# EAGLE board ickenham (EAGLE 9.6.2)
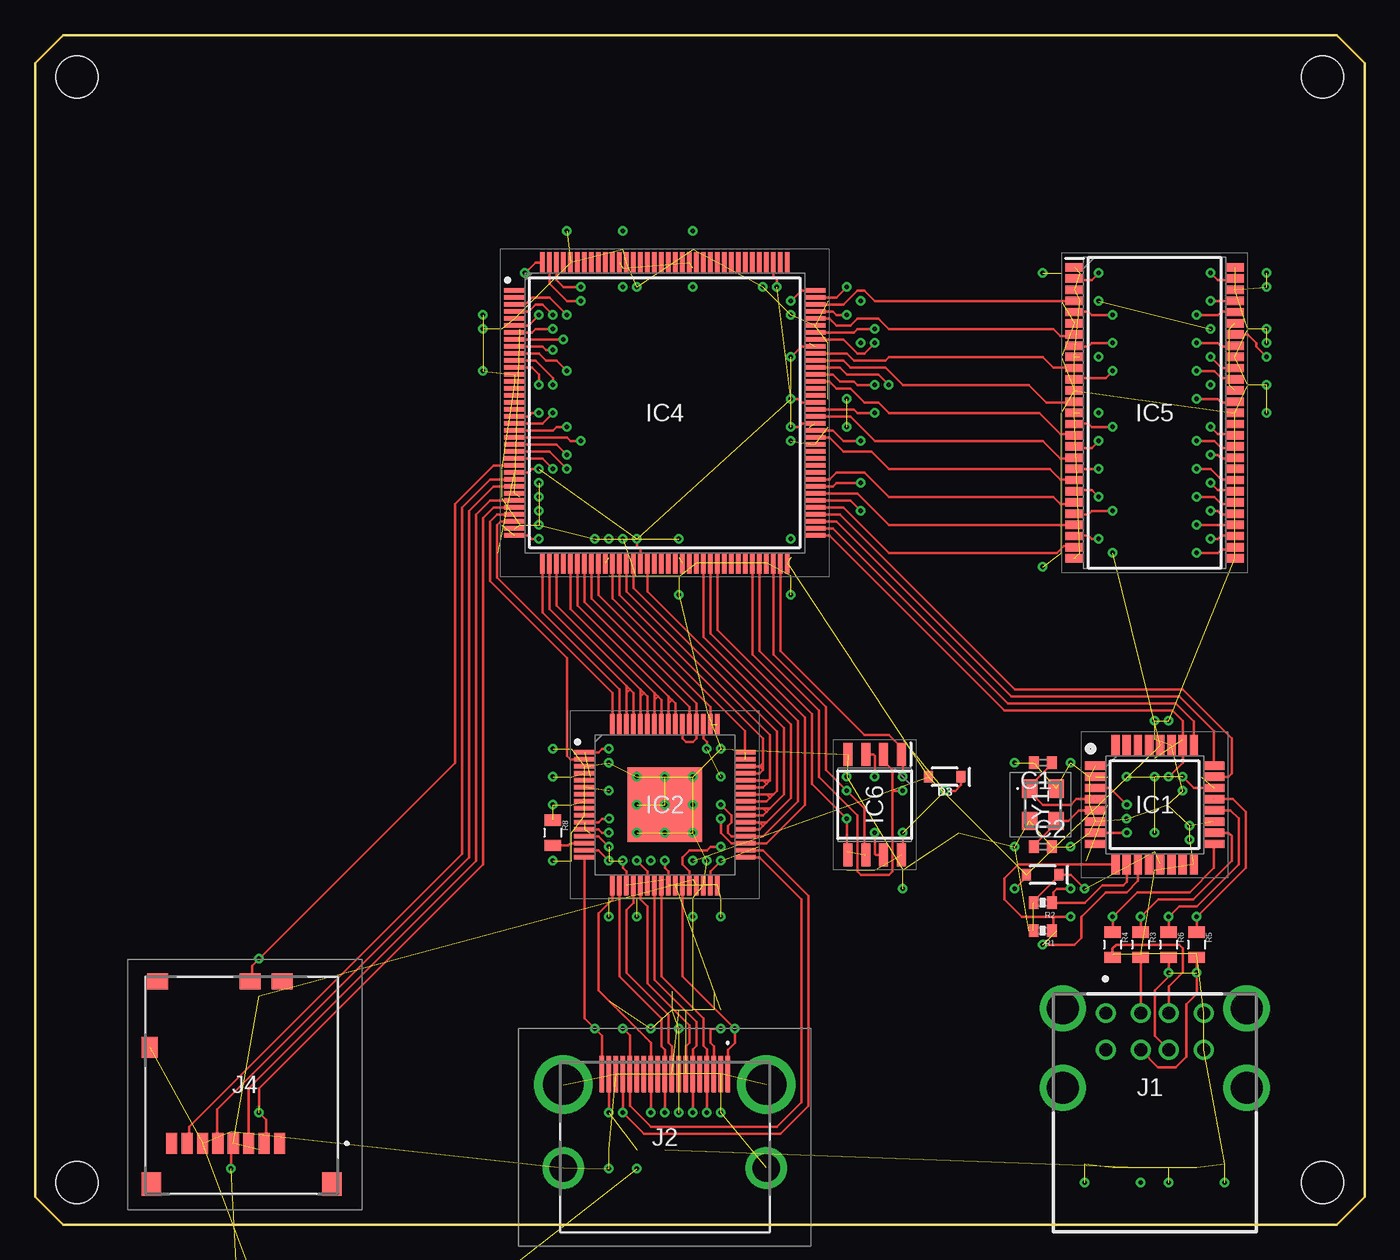
[diagram p6: board, top side]
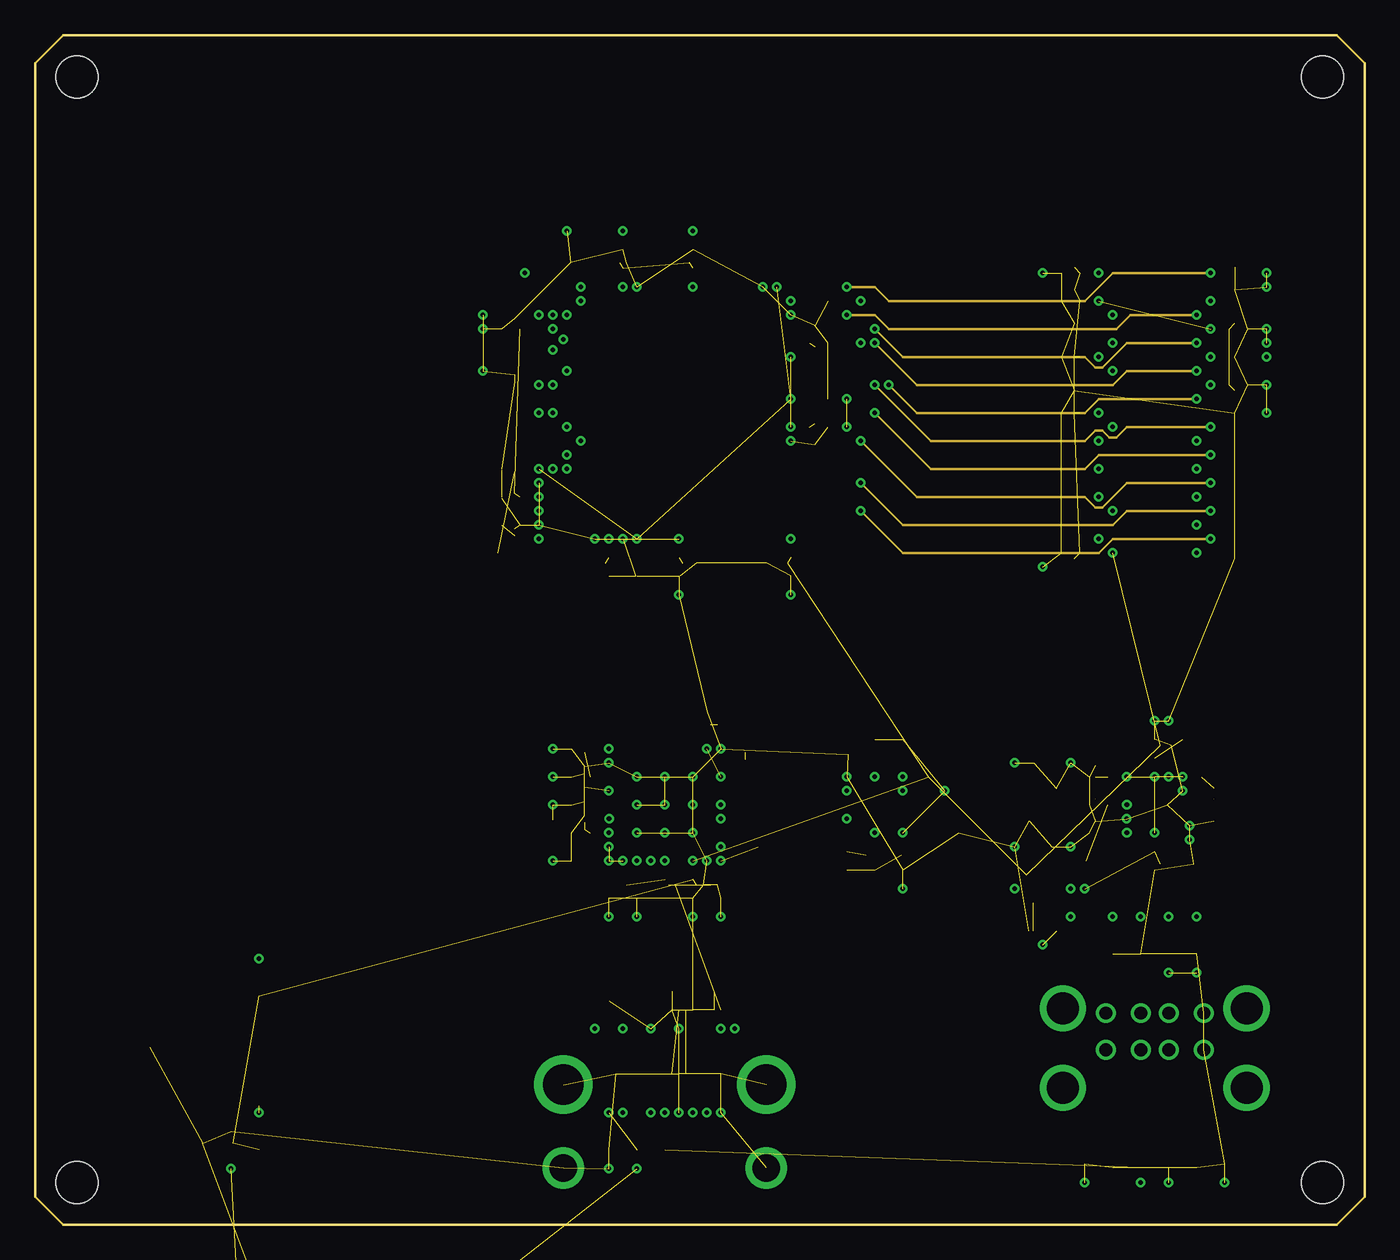
[diagram p7: board, inner layer TopInner]
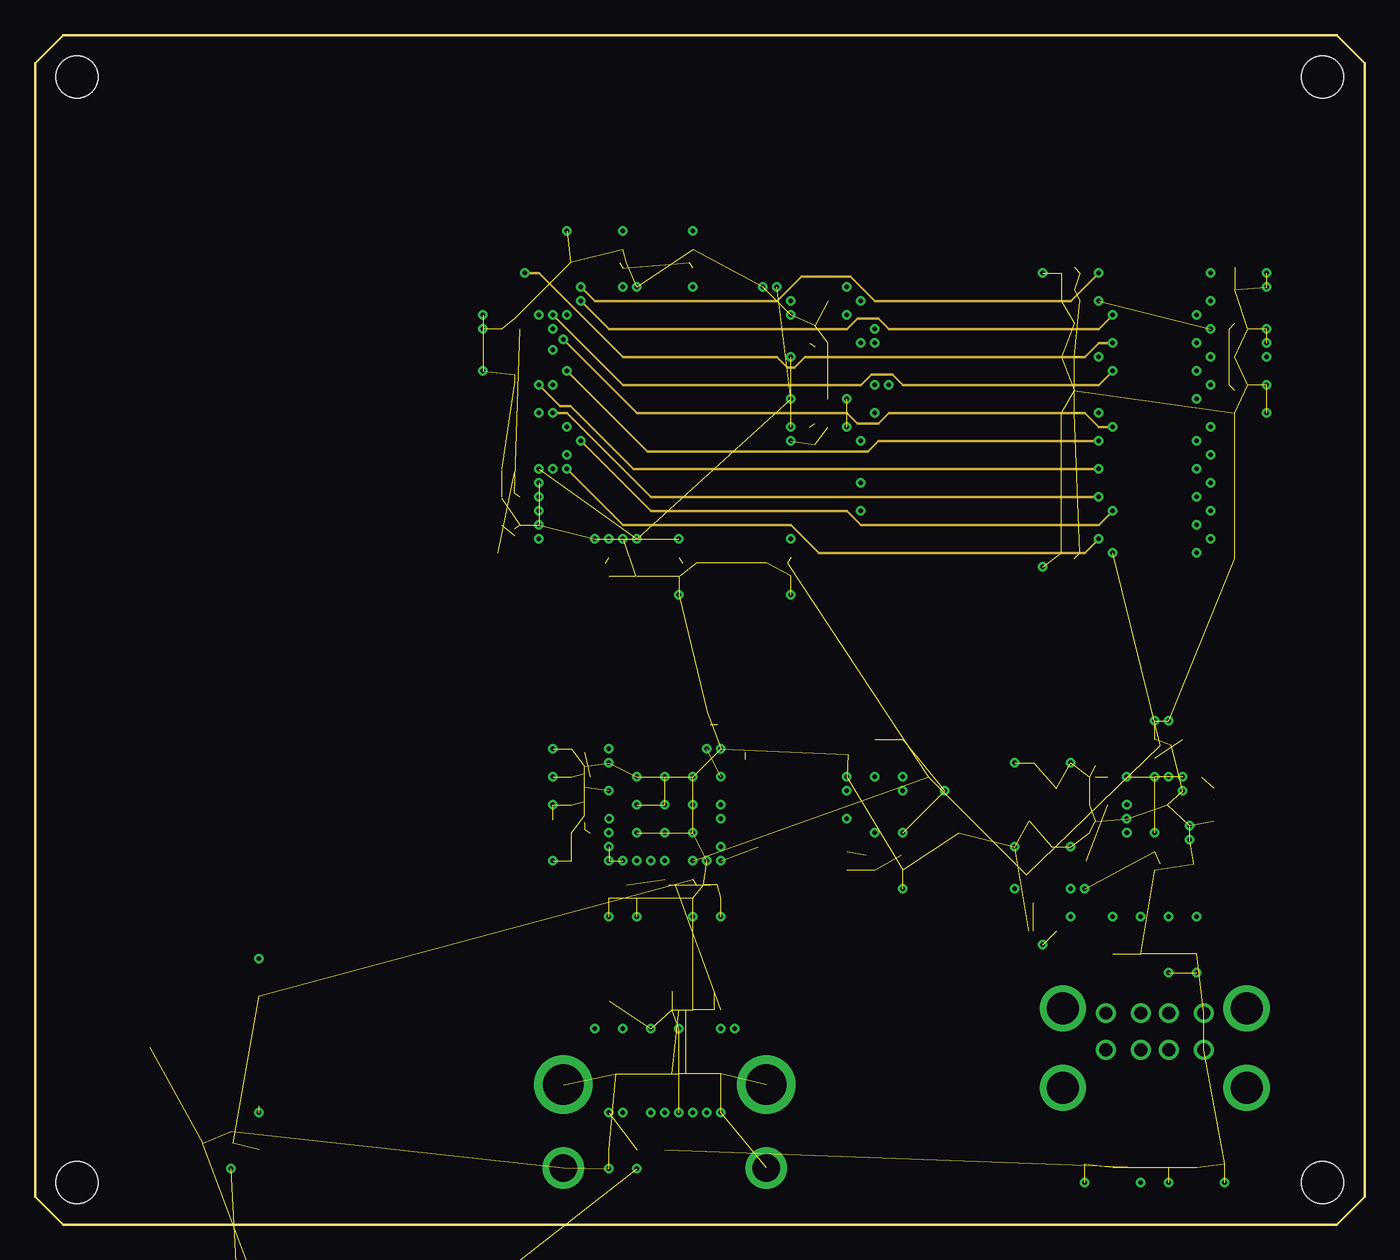
[diagram p8: board, inner layer BottomInner]
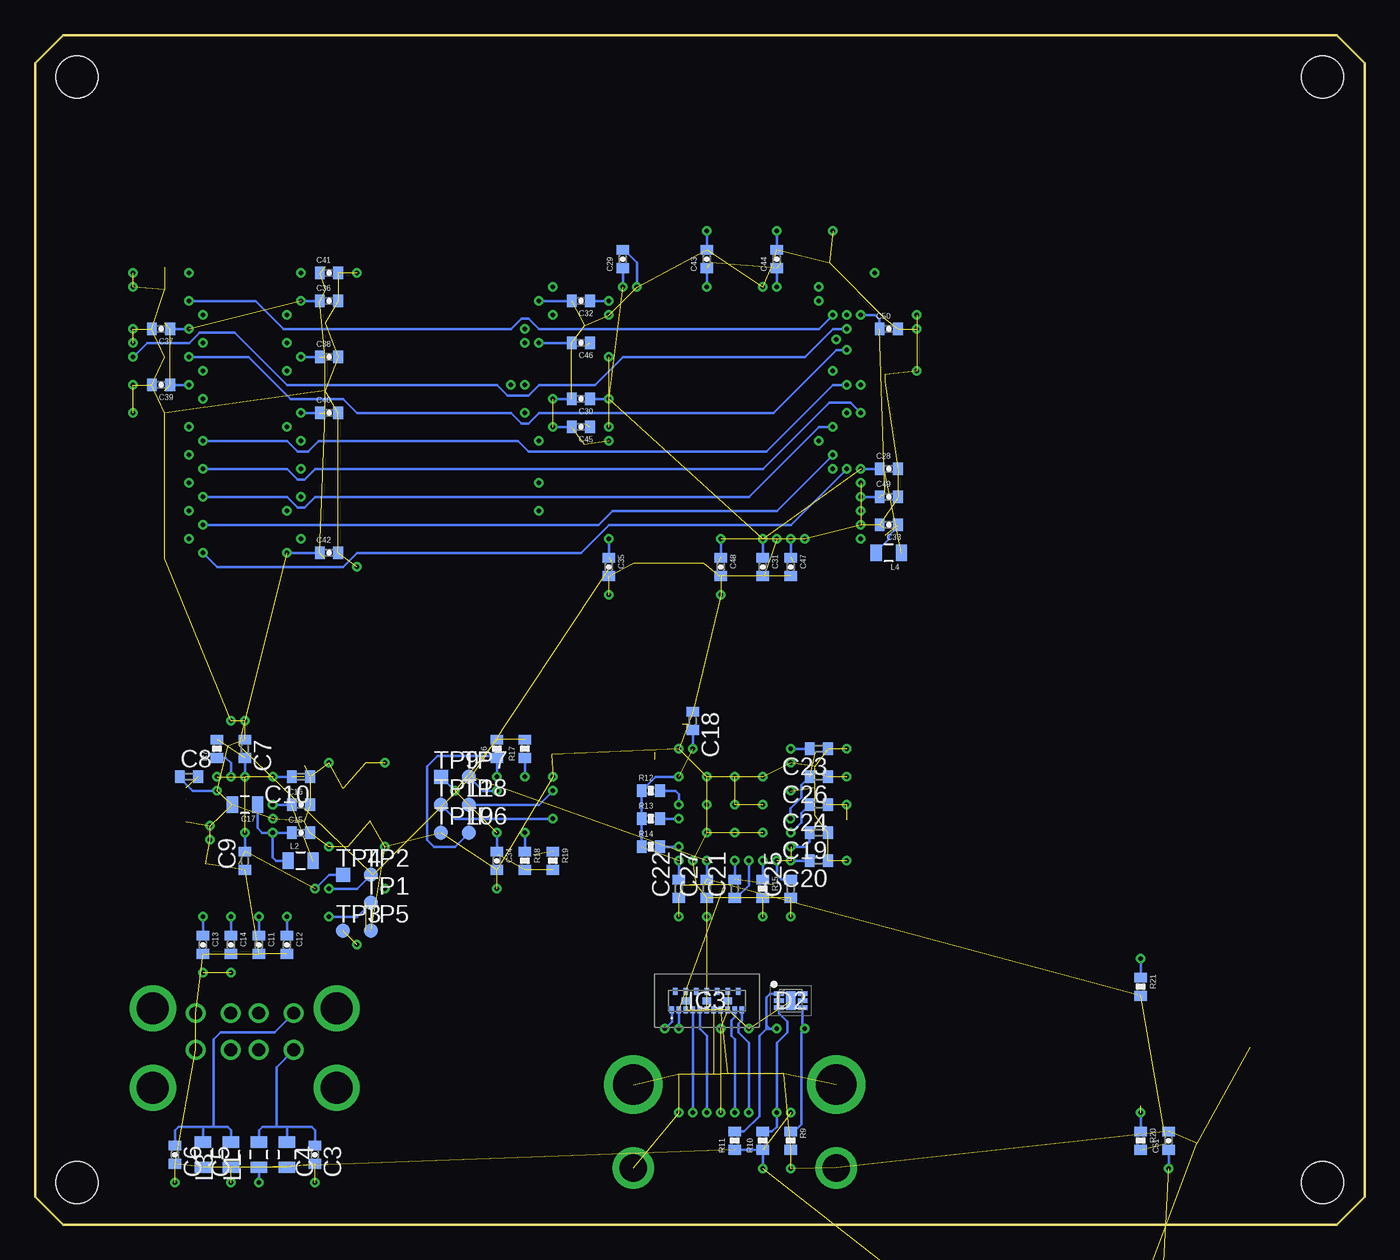
[diagram p9: board, bottom side, seen from below]

Size 95 x 85 mm. Coordinates in mm from the lower left corner, seen from the top.
Outline: 95,83 95,2 93,0 2,0 0,2 0,83 2,85 93,85 95,83
Copper layers (1+2*3+14*15+16): Top 0.035mm / dielectric 0.15mm / TopInner 0.035mm / dielectric 0.15mm / Vcc 0.035mm / dielectric 0.2mm / Gnd 0.035mm / dielectric 0.15mm / BottomInner 0.035mm / dielectric 0.15mm / Bottom 0.035mm
Design rules "default *": minimum track width 4mil, minimum drill 0.2mm, track to track 4mil, track to pad 4mil, pad to pad 4mil, via to via 4mil, smd to smd 4mil, copper to edge 10mil, drill to drill 4mil, minimum pad ring 10mil, minimum via ring 4mil, stop-mask expansion 4mil, vias tented up to drill 0mil, thermal gap 10mil
Holes 3 mm at 3,3 92,3 3,82 92,82

## Footprints (pad centres in the part's own frame; a part is rotated, then mirrored left to right if it is on the bottom)
1210 = smd 1.2 x 2: 1 -1.6,0; 2 1.6,0
1206 = smd 1.6 x 1.8: 1 -1.4,0; 2 1.4,0
0402-RES = smd 0.7 x 0.9: 1 -0.65,0; 2 0.65,0
0402-CAP = smd 0.7 x 0.9: 1 -0.65,0; 2 0.65,0
C0402 = smd 0.7 x 0.9: 1 -0.65,0; 2 0.65,0
0805 = smd 0.8 x 1.2: 1 -0.9,0; 2 0.9,0
SOD-323 = smd 0.63 x 0.83: A 1.15,0; C -1.15,0
SON50P160X160X65-7N = smd 0.7 x 0.3: 1 -0.85,0.5; 2 -0.85,0; 3 -0.85,-0.5; 4 0.85,-0.5; 5 0.85,0; 6 0.85,0.5 | smd 0.65 x 1.3: 7 0,0
QFP80P900X900X160-32N = smd 1.475 x 0.6: 1 -4.238,2.8; 2 -4.238,2; 3 -4.238,1.2; 4 -4.238,0.4; 5 -4.238,-0.4; 6 -4.238,-1.2; 7 -4.238,-2; 8 -4.238,-2.8; 17 4.238,-2.8; 18 4.238,-2; 19 4.238,-1.2; 20 4.238,-0.4; 21 4.238,0.4; 22 4.238,1.2; 23 4.238,2; 24 4.238,2.8 | smd 0.6 x 1.475: 9 -2.8,-4.238; 10 -2,-4.238; 11 -1.2,-4.238; 12 -0.4,-4.238; 13 0.4,-4.238; 14 1.2,-4.238; 15 2,-4.238; 16 2.8,-4.238; 25 2.8,4.238; 26 2,4.238; 27 1.2,4.238; 28 0.4,4.238; 29 -0.4,4.238; 30 -1.2,4.238; 31 -2,4.238; 32 -2.8,4.238
QFP50P1200X1200X160-65N = smd 1.475 x 0.3: 1 -5.738,3.75; 2 -5.738,3.25; 3 -5.738,2.75; 4 -5.738,2.25; 5 -5.738,1.75; 6 -5.738,1.25; 7 -5.738,0.75; 8 -5.738,0.25; 9 -5.738,-0.25; 10 -5.738,-0.75; 11 -5.738,-1.25; 12 -5.738,-1.75; 13 -5.738,-2.25; 14 -5.738,-2.75; 15 -5.738,-3.25; 16 -5.738,-3.75; 33 5.738,-3.75; 34 5.738,-3.25; 35 5.738,-2.75; 36 5.738,-2.25; 37 5.738,-1.75; 38 5.738,-1.25; 39 5.738,-0.75; 40 5.738,-0.25; 41 5.738,0.25; 42 5.738,0.75; 43 5.738,1.25; 44 5.738,1.75; 45 5.738,2.25; 46 5.738,2.75; 47 5.738,3.25; 48 5.738,3.75 | smd 0.3 x 1.475: 17 -3.75,-5.738; 18 -3.25,-5.738; 19 -2.75,-5.738; 20 -2.25,-5.738; 21 -1.75,-5.738; 22 -1.25,-5.738; 23 -0.75,-5.738; 24 -0.25,-5.738; 25 0.25,-5.738; 26 0.75,-5.738; 27 1.25,-5.738; 28 1.75,-5.738; 29 2.25,-5.738; 30 2.75,-5.738; 31 3.25,-5.738; 32 3.75,-5.738; 49 3.75,5.738; 50 3.25,5.738; 51 2.75,5.738; 52 2.25,5.738; 53 1.75,5.738; 54 1.25,5.738; 55 0.75,5.738; 56 0.25,5.738; 57 -0.25,5.738; 58 -0.75,5.738; 59 -1.25,5.738; 60 -1.75,5.738; 61 -2.25,5.738; 62 -2.75,5.738; 63 -3.25,5.738; 64 -3.75,5.738 | smd 5.3 x 5.3: 65 0,0
ESD7008MUTAG = smd 0.3 x 0.5: 1 -2.5,-0.65; 2 -2,-0.65; 3 -1.5,-0.65; 4 -1,-0.65; 5 -0.5,-0.65; 6 0,-0.65; 7 0.5,-0.65; 8 1,-0.65; 9 1.5,-0.65; 10 2,-0.65; 11 2.5,-0.65; 12 2.25,0.65; 13 1.5,0.65; 14 0.75,0.65; 15 0,0.65; 16 -0.75,0.65; 17 -1.5,0.65; 18 -2.25,0.65 | smd 0.6 x 0.5: 19 -1.5,0; 20 0,0; 21 1.5,0
QFP50P2200X2200X160-144N = smd 1.475 x 0.3: 1 -10.738,8.75; 2 -10.738,8.25; 3 -10.738,7.75; 4 -10.738,7.25; 5 -10.738,6.75; 6 -10.738,6.25; 7 -10.738,5.75; 8 -10.738,5.25; 9 -10.738,4.75; 10 -10.738,4.25; 11 -10.738,3.75; 12 -10.738,3.25; 13 -10.738,2.75; 14 -10.738,2.25; 15 -10.738,1.75; 16 -10.738,1.25; 17 -10.738,0.75; 18 -10.738,0.25; 19 -10.738,-0.25; 20 -10.738,-0.75; 21 -10.738,-1.25; 22 -10.738,-1.75; 23 -10.738,-2.25; 24 -10.738,-2.75; 25 -10.738,-3.25; 26 -10.738,-3.75; 27 -10.738,-4.25; 28 -10.738,-4.75; 29 -10.738,-5.25; 30 -10.738,-5.75; 31 -10.738,-6.25; 32 -10.738,-6.75; 33 -10.738,-7.25; 34 -10.738,-7.75; 35 -10.738,-8.25; 36 -10.738,-8.75; 73 10.738,-8.75; 74 10.738,-8.25; 75 10.738,-7.75; 76 10.738,-7.25; 77 10.738,-6.75; 78 10.738,-6.25; 79 10.738,-5.75; 80 10.738,-5.25; 81 10.738,-4.75; 82 10.738,-4.25; 83 10.738,-3.75; 84 10.738,-3.25; 85 10.738,-2.75; 86 10.738,-2.25; 87 10.738,-1.75; 88 10.738,-1.25; 89 10.738,-0.75; 90 10.738,-0.25; 91 10.738,0.25; 92 10.738,0.75; 93 10.738,1.25; 94 10.738,1.75; 95 10.738,2.25; 96 10.738,2.75; 97 10.738,3.25; 98 10.738,3.75; 99 10.738,4.25; 100 10.738,4.75; 101 10.738,5.25; 102 10.738,5.75; 103 10.738,6.25; 104 10.738,6.75; 105 10.738,7.25; 106 10.738,7.75; 107 10.738,8.25; 108 10.738,8.75 | smd 0.3 x 1.475: 37 -8.75,-10.738; 38 -8.25,-10.738; 39 -7.75,-10.738; 40 -7.25,-10.738; 41 -6.75,-10.738; 42 -6.25,-10.738; 43 -5.75,-10.738; 44 -5.25,-10.738; 45 -4.75,-10.738; 46 -4.25,-10.738; 47 -3.75,-10.738; 48 -3.25,-10.738; 49 -2.75,-10.738; 50 -2.25,-10.738; 51 -1.75,-10.738; 52 -1.25,-10.738; 53 -0.75,-10.738; 54 -0.25,-10.738; 55 0.25,-10.738; 56 0.75,-10.738; 57 1.25,-10.738; 58 1.75,-10.738; 59 2.25,-10.738; 60 2.75,-10.738; 61 3.25,-10.738; 62 3.75,-10.738; 63 4.25,-10.738; 64 4.75,-10.738; 65 5.25,-10.738; 66 5.75,-10.738; 67 6.25,-10.738; 68 6.75,-10.738; 69 7.25,-10.738; 70 7.75,-10.738; 71 8.25,-10.738; 72 8.75,-10.738; 109 8.75,10.738; 110 8.25,10.738; 111 7.75,10.738; 112 7.25,10.738; 113 6.75,10.738; 114 6.25,10.738; 115 5.75,10.738; 116 5.25,10.738; 117 4.75,10.738; 118 4.25,10.738; 119 3.75,10.738; 120 3.25,10.738; 121 2.75,10.738; 122 2.25,10.738; 123 1.75,10.738; 124 1.25,10.738; 125 0.75,10.738; 126 0.25,10.738; 127 -0.25,10.738; 128 -0.75,10.738; 129 -1.25,10.738; 130 -1.75,10.738; 131 -2.25,10.738; 132 -2.75,10.738; 133 -3.25,10.738; 134 -3.75,10.738; 135 -4.25,10.738; 136 -4.75,10.738; 137 -5.25,10.738; 138 -5.75,10.738; 139 -6.25,10.738; 140 -6.75,10.738; 141 -7.25,10.738; 142 -7.75,10.738; 143 -8.25,10.738; 144 -8.75,10.738
SOP80P1176X120-54N = smd 1.295 x 0.6: 1 -5.728,10.4; 2 -5.728,9.6; 3 -5.728,8.8; 4 -5.728,8; 5 -5.728,7.2; 6 -5.728,6.4; 7 -5.728,5.6; 8 -5.728,4.8; 9 -5.728,4; 10 -5.728,3.2; 11 -5.728,2.4; 12 -5.728,1.6; 13 -5.728,0.8; 14 -5.728,0; 15 -5.728,-0.8; 16 -5.728,-1.6; 17 -5.728,-2.4; 18 -5.728,-3.2; 19 -5.728,-4; 20 -5.728,-4.8; 21 -5.728,-5.6; 22 -5.728,-6.4; 23 -5.728,-7.2; 24 -5.728,-8; 25 -5.728,-8.8; 26 -5.728,-9.6; 27 -5.728,-10.4; 28 5.728,-10.4; 29 5.728,-9.6; 30 5.728,-8.8; 31 5.728,-8; 32 5.728,-7.2; 33 5.728,-6.4; 34 5.728,-5.6; 35 5.728,-4.8; 36 5.728,-4; 37 5.728,-3.2; 38 5.728,-2.4; 39 5.728,-1.6; 40 5.728,-0.8; 41 5.728,0; 42 5.728,0.8; 43 5.728,1.6; 44 5.728,2.4; 45 5.728,3.2; 46 5.728,4; 47 5.728,4.8; 48 5.728,5.6; 49 5.728,6.4; 50 5.728,7.2; 51 5.728,8; 52 5.728,8.8; 53 5.728,9.6; 54 5.728,10.4
SOIC127P790X216-8N = smd 1.65 x 0.65: 1 -3.6,1.905; 2 -3.6,0.635; 3 -3.6,-0.635; 4 -3.6,-1.905; 5 3.6,-1.905; 6 3.6,-0.635; 7 3.6,0.635; 8 3.6,1.905
SOT95P280X100-6N = smd 1.05 x 0.55: 1 -1.3,0.95; 2 -1.3,0; 3 -1.3,-0.95; 4 1.3,-0.95; 5 1.3,0; 6 1.3,0.95
DUAL_USB_2.0_TYPE-A = drill 0.9 pad 1.4: 1 -3.5,15.61; 2 -1,15.61; 3 1,15.61; 4 3.5,15.61; 5 -3.5,12.99; 6 -1,12.99; 7 1,12.99; 8 3.5,12.99 | drill 2.3 pad 3.3: 9 -6.57,15.96; 10 6.57,15.96; 11 6.57,10.28; 12 -6.57,10.28
2086581001 = smd 0.3 x 2.6: 1 4.5,0.76; 2 4,0.76; 3 3.5,0.76; 4 3,0.76; 5 2.5,0.76; 6 2,0.76; 7 1.5,0.76; 8 1,0.76; 9 0.5,0.76; 10 0,0.76; 11 -0.5,0.76; 12 -1,0.76; 13 -1.5,0.76; 14 -2,0.76; 15 -2.5,0.76; 16 -3,0.76; 17 -3.5,0.76; 18 -4,0.76; 19 -4.5,0.76 | drill 2.909 pad 4.2: MH1 7.25,0; MH4 -7.25,0 | drill 1.991 pad 2.8: MH2 7.25,-5.96; MH3 -7.25,-5.96
5025700893 = smd 0.8 x 1.5: 1 -2.475,4.2; 2 -1.375,4.2; 3 -0.275,4.2; 4 0.825,4.2; 5 1.925,4.2; 6 3.025,4.2; 7 4.125,4.2; 8 5.225,4.2 | smd 1.15 x 1.5: 9 6.8,-2.65 | smd 1.5 x 1.15: 10 -0.375,-7.375; 11 6.225,-7.375; 12 -2.675,-7.375 | smd 1.4 x 1.7: 13 -6.225,7.1; 14 6.675,7.1
TP10R = smd 1 x 1: TP 0,0
TP10SQ = smd 1 x 1: TP 0,0
ABM8AIG25000MHZ122ZT3 = smd 1.3 x 1.1: 1 -1.15,-0.95; 2 1.15,-0.95; 3 1.15,0.95; 4 -1.15,0.95

## Placement (x,y rotation side)
4.7U  [1210]  25,-15 0 top  (outside the outline)
22U  [1206]  23,-19 180 top  (outside the outline)
30K  [0402-RES]  18,-12 180 top  (outside the outline)
47PF  [0402-CAP]  17,-14 90 top  (outside the outline)
93K  [0402-RES]  15,-14 270 top  (outside the outline)
100N  [0402-CAP]  22,-12 0 top  (outside the outline)
C1  22pf  [C0402]  72.02,33 180 top
C2  22pf  [C0402]  72.02,27 0 top
C3  100n  [0402-CAP]  75,5 270 bottom
C4  120u  [0805]  77,5 270 bottom
C5  120u  [0805]  83,5 270 bottom
C6  100n  [0402-CAP]  85,5 270 bottom
C7  100n  [C0402]  80,34 270 bottom
C8  100n  [C0402]  84,32 0 bottom
C9  100n  [C0402]  80,26 90 bottom
C10  100n  [C0402]  76,32 180 bottom
C11  47p  [0402-CAP]  79,20 270 bottom
C12  47p  [0402-CAP]  77,20 270 bottom
C13  47p  [0402-CAP]  83,20 270 bottom
C14  47p  [0402-CAP]  81,20 270 bottom
C15  100n  [0402-CAP]  76,28 0 bottom
C16  100n  [0402-CAP]  76,30 0 bottom
C17  4u7  [0805]  80,30 180 bottom
C18  100n  [C0402]  48,36 270 bottom
C19  100n  [C0402]  39,28 180 bottom
C20  100n  [C0402]  39,26 180 bottom
C21  100n  [C0402]  45,24 90 bottom
C22  100n  [C0402]  49,24 90 bottom
C23  100n  [C0402]  39,34 180 bottom
C24  100n  [C0402]  39,30 180 bottom
C25  100n  [C0402]  41,24 90 bottom
C26  100n  [C0402]  39,32 180 bottom
C27  100n  [C0402]  47,24 90 bottom
C28  100n  [0402-CAP]  34,54 0 bottom
C29  100n  [0402-CAP]  53,69 90 bottom
C30  100n  [0402-CAP]  56,59 180 bottom
C31  100n  [0402-CAP]  43,47 270 bottom
C32  100n  [0402-CAP]  56,66 180 bottom
C33  [0402-CAP]  34,50 180 bottom
C34  [0402-CAP]  62,26 270 bottom
C35  100n  [0402-CAP]  54,47 270 bottom
C36  100n  [0402-CAP]  74,66 0 bottom
C37  100n  [0402-CAP]  86,64 180 bottom
C38  100n  [0402-CAP]  74,62 0 bottom
C39  100n  [0402-CAP]  86,60 180 bottom
C40  100n  [0402-CAP]  74,58 0 bottom
C41  100n  [0402-CAP]  74,68 0 bottom
C42  100n  [0402-CAP]  74,48 0 bottom
C43  100n  [0402-CAP]  47,69 90 bottom
C44  100n  [0402-CAP]  42,69 90 bottom
C45  100n  [0402-CAP]  56,57 180 bottom
C46  100n  [0402-CAP]  56,63 180 bottom
C47  100n  [0402-CAP]  41,47 270 bottom
C48  100n  [0402-CAP]  46,47 270 bottom
C49  100n  [0402-CAP]  34,52 0 bottom
C50  100n  [0402-CAP]  34,64 0 bottom
C51  100n  [0402-CAP]  14,6 90 bottom
C53  [1206]  17,-19 0 top  (outside the outline)
D1  3.6V  [SOD-323]  72,25 180 top
D2  RCLAMP0504P.TCT  [SON50P160X160X65-7N]  41,16 0 bottom
D3  3.6V  [SOD-323]  65,32 180 top
IC1  VNC2-32L1C-REEL  [QFP80P900X900X160-32N]  80,30 0 top
IC2  ADV7513BSWZ  [QFP50P1200X1200X160-65N]  45,30 0 top
IC3  ESD7008MUTAG  [ESD7008MUTAG]  47,16 0 bottom
IC4  ICE40HX1K-TQ144  [QFP50P2200X2200X160-144N]  45,58 0 top
IC5  IS42S16400J-6TL  [SOP80P1176X120-54N]  80,58 0 top
IC6  W25Q128JVSIM_TR  [SOIC127P790X216-8N]  60,30 270 top
IC7  AP63301WU-7  [SOT95P280X100-6N]  20,-15 0 top  (outside the outline)
J1  61400826021  [DUAL_USB_2.0_TYPE-A]  80.02,-0.51 0 top
J2  208658-1001  [2086581001]  45,10 0 top
J4  5025700893  [5025700893]  15,10 180 top
L1  600R : 100MHz  [0805]  79,5 90 bottom
L2  600R : 100MHz  [0805]  76.02,26 0 bottom
L3  600R : 100MHz  [0805]  81,5 90 bottom
L4  [0805]  34,48 180 bottom
R1  4k7  [0402-RES]  72,21 180 top
R2  4k7  [0402-RES]  72,23 180 top
R3  27R  [0805]  79,20 270 top
R4  27R  [0805]  77,20 270 top
R5  27R  [0805]  83,20 270 top
R6  27R  [0805]  81,20 270 top
R7  4k7  [0402-RES]  82,34 90 bottom
R8  887R 1%  [0805]  37,28 270 top
R9  4k7  [0402-RES]  41,6 270 bottom
R10  2k  [0402-RES]  43,6 90 bottom
R11  2k  [0402-RES]  45,6 90 bottom
R12  2k  [0402-RES]  51,31 0 bottom
R13  2k  [0402-RES]  51,29 0 bottom
R14  2k  [0402-RES]  51,27 0 bottom
R15  2k  [0402-RES]  43,24 270 bottom
R16  4k7  [0402-RES]  62,34 90 bottom
R17  4k7  [0402-RES]  60,34 90 bottom
R18  4k7  [0402-RES]  60,26 270 bottom
R19  4k7  [0402-RES]  58,26 270 bottom
R20  4k7  [0402-RES]  16,6 270 bottom
R21  4k7  [0402-RES]  16,17 270 bottom
TP1  TPTP10R  [TP10R]  71,23 0 bottom
TP2  TPTP10R  [TP10R]  71,25 0 bottom
TP3  TPTP10R  [TP10R]  73,21 0 bottom
TP4  TPTP10SQ  [TP10SQ]  73,25 0 bottom
TP5  TPTP10R  [TP10R]  71,21 0 bottom
TP6  TPTP10R  [TP10R]  64,28 0 bottom
TP7  TPTP10R  [TP10R]  64,32 0 bottom
TP8  TPTP10R  [TP10R]  64,30 0 bottom
TP9  TPTP10SQ  [TP10SQ]  66,32 0 bottom
TP10  TPTP10R  [TP10R]  66,28 0 bottom
TP11  TPTP10R  [TP10R]  66,30 0 bottom
Y1  ABM8AIG-12.000MHZ-12-2Z-T3  [ABM8AIG25000MHZ122ZT3]  72.02,30 270 top

## Tracks (layer width: path | path; a pad name or v marks a point on that pad's centre or on a via)
1.2V  (via drill 0.35 pad 0.7)  (4 unrouted)
  Top 0.191: IC4.111 52.75,67.75 53,67.5 v53,67 | IC4.27 35.25,53.75 35.5,54 v36,54 | IC4.51 43.25,48.25 43,48.5 v43,49 | IC4.92 54.75,58.75 54.5,59 v54,59
  Bottom 0.191: C31.1 v43,49 | C28.1 v36,54 | C29.1 v53,67 | C30.1 v54,59
1.8V  (via drill 0.35 pad 0.7)  (9 unrouted)
  Top 0.191: IC2.11 40.28,28.75 40.53,29 v41.03,29 | IC2.12 40.25,28.25 40.5,28 v41,28 | IC2.13 40.25,27.75 v41,27 | IC2.15 40.25,26.75 v41,26 | IC2.1 40.25,33.75 40.5,34 v41,34 | IC2.51 47.75,34.75 48,34.5 v48,34 | IC2.31 48.25,25.25 v49,26 | IC2.25 45.25,25.25 45,25.5 v45,26 | IC2.19 42.25,25.25 42,25.5 v42,26
  Bottom 0.191: C23.2 v41,34 | C20.2 v41,26 | v41,27 40,27 39.65,27.35 C19.2 | C24.2 40.25,29.4 40.25,28.75 v41,28 | C26.2 40.25,31.4 40.25,30.53 41.03,29.75 v41.03,29 | C22.2 v49,26 | C18.2 v48,34 | v49,32 50.65,32 R12.1 R13.1 R14.1 | C21.2 v45,26 | C25.2 41.65,24.65 42,25 v42,26
2.5V  (via drill 0.35 pad 0.7)
  Top 0.191: IC4.108 54.75,66.75 v54,66
  Bottom 0.191: C32.1 v54,66
3.3V  (via drill 0.35 pad 0.7)  (27 unrouted)
  Top 0.191: D1.A 70.85,24.85 v70,24 | J4.4 14,5.62 v14,4
  Bottom 0.191: C27.2 v47,26 | C40.1 v76,58 | v76,62 C38.1 | C36.1 v76,66 | C37.1 v84,64 | C39.1 v84,60 | C42.1 v77,48 | C51.1 v14,4 | C35.1 v54,49
5V  (via drill 0.35 pad 0.7)  (7 unrouted)
  Top 0.191: J2.18 v41,8
  Bottom 0.191: L1.1 v79,3 | R10.1 43,5 | 43,5 v43,4 | R11.1 43.35,5.35 43,5
  other vias: 81,3
!BITFLASH_CS  (via drill 0.35 pad 0.7)
  Top 0.191: IC4.71 53.25,41 59.25,35 61,35 62,34 62,33.7 IC6.1 62,33.51 v62,32
  Bottom 0.191: v62,32 R16.1 62.15,33.5 66.25,33.5 67,32.75 67,27.5 66.5,27 65,27 TP6.TP
!HOST_PROGRAM  (via drill 0.35 pad 0.7)
  Top 0.191: R1.1 72.75,21.1 72.75,22 | 72.75,22 70.5,22 69.25,23.25 69.25,24.75 70.25,25.75 77.19,25.75 IC1.9 | 72.75,22 v74,22
  Bottom 0.191: TP1.TP 72,22 v74,22
!HOST_RESET  (via drill 0.35 pad 0.7)
  Top 0.191: R2.1 72.75,23.1 | 72.75,23.1 72.75,23 75,23 76.25,24.25 77.75,24.25 78,24.5 IC1.10 | 72.75,23.1 72.75,23.75 73,24 v74,24
  Bottom 0.191: TP2.TP 72,24 v74,24
!HOST_SS  (via drill 0.35 pad 0.7)
  Top 0.191: v81,32 82,33 IC1.26 82,36 81.25,36.75 69.25,36.75 56.75,49.25 IC4.73
  Bottom 0.191: v81,32 81,32.98 81.37,33.35 R7.1
!SD_CD  (via drill 0.35 pad 0.7)  (1 unrouted)
  Top 0.191: v16,8 16.5,7.5 16.5,6 16.38,5.88 J4.2 | IC4.32 32.75,51.25 32,50.5 32,25.75 16,9.75 16,8.5
  Bottom 0.191: R20.1 v16,8
!SD_DETECT  (via drill 0.35 pad 0.7)
  Top 0.191: J4.10 15.5,17.5 15.5,18.5 v16,19 30,33 30,51.5 32.75,54.25 IC4.26
  Bottom 0.191: R21.1 v16,19
!VDRAM_CAS  (via drill 0.35 pad 0.7)
  Top 0.191: IC5.17 74.37,55.5 75.5,55.5 v76,56 | v38,61 37.25,61.75 36.5,61.75 36,62.25 34.75,62.25
  BottomInner 0.191: v76,56 60.25,56 59.5,55.25 43.75,55.25 v38,61
!VDRAM_CS  (via drill 0.35 pad 0.7)
  Top 0.191: IC5.19 v76,54 | v36,60 36,60.75 35.5,61.25 34.75,61.25
  BottomInner 0.191: v76,54 42.75,54 38.25,58.5 37.5,58.5 v36,60
!VDRAM_RAS
  Top 0.191: IC5.18 74.22,54.75 73.25,54.75 72,56 60,56 58.25,57.75 IC4.90
!VDRAM_WE
  Top 0.191: IC5.16 74.17,56.5 73.25,56.5 71.75,58 61,58 60.25,58.75 59.25,58.75 58.25,59.75 57.25,59.75 56.75,60.25 56.25,60.25
BITFLASH_CLK  (via drill 0.35 pad 0.7)  (1 unrouted)
  Top 0.191: IC4.70 52.75,40.75 56.5,37 56.5,32.5 v58,31 59.25,29.75 59.25,26.52 IC6.6
  Bottom 0.191: TP8.TP 59,30 v58,31
BITFLASH_MISO  (via drill 0.35 pad 0.7)
  Top 0.191: IC4.68 51.75,41 56,36.75 56,32 58.75,29.25 58.75,25.25 59,25 61,25 61.25,25.25 61.25,31 | 61.25,31 61.25,32.5 60.63,33.12 IC6.2 | 61.25,31 v62,31
  Bottom 0.191: TP7.TP 63,31 v62,31
BITFLASH_MOSI  (via drill 0.35 pad 0.7)
  Top 0.191: IC4.67 51.25,40.75 55.5,36.5 55.5,31.5 v58,29 58,26.5 IC6.5 58.09,26.91
  Bottom 0.191: TP11.TP 65,29 v58,29
BITFLASH_VCC  (via drill 0.35 pad 0.7)  (5 unrouted)
  Top 0.191: D3.C 66.15,31.4 65.75,31 v65,31 | IC6.8 62,26.5 v62,28
  Bottom 0.191: TP9.TP v65,31 | v62,28 C34.1
FPGA_VCCIO0  (via drill 0.35 pad 0.7)  (3 unrouted)
  Bottom 0.191: C44.1 v42,67 | C43.1 v47,67
FPGA_VCCIO1  (via drill 0.35 pad 0.7)  (3 unrouted)
  Top 0.191: IC4.89 54.86,57.25 54.61,57 v54,57 | v54,62 54.75,62.75 IC4.100
FPGA_VCCIO2  (via drill 0.35 pad 0.7)  (3 unrouted)
  Bottom 0.191: C48.1 v46,49 | C47.1 v41,49
FPGA_VCCIO3  (via drill 0.35 pad 0.7)  (2 unrouted)
  Top 0.191: IC4.6 35.25,64.25 v36,65
  Bottom 0.191: C49.1 v36,52 | v36,65 35,65 34.65,64.65 C50.1
FPGA_VPLL  (via drill 0.35 pad 0.7)  (1 unrouted)
  Top 0.191: IC4.36 35.25,49.25 35.5,49 v36,49
  Bottom 0.191: 35,48 L4.2 34.9,48.1 34,49 34,49.25 33.35,49.9 C33.1
GND  (via drill 0.35 pad 0.7)  (175 unrouted)
  Bottom 0.191: C43.2 v47,71 | C44.2 v42,71 | v52,67 52,68.75 52.9,69.65 C29.2 | v59,66 C32.2 | v58,59 C30.2 | v58,57 C45.2 | C48.2 46.1,46.35 | C31.2 42.9,46.35 | C47.2 40.9,46.35 | C21.1 44.9,23.35 44,24.25 v44,26 | v59,63 C46.2 | v82,31 83.75,31 84.65,31.9 C8.1 | C28.2 33.35,53.9 | C49.2 33.35,51.9
  other vias: 82.5,28.5 75,3 85,3 82.5,27.5 74,33 74,27 70,33 70,27 81,36 45,30 45,32 43,30 45,28 47,30 47,32 43,32 43,28 47,28 48,26 41,33 41,31 37,34 37,32 37,30 37,26 44,14 46,8 49,8 49,34 80,36 41,4 41,22 43,22 47,22 49,22 46,14 78,29 36,50 32,61 32,65 43,67 46,45 38,71 36,53 42,49 58,32 72,68 72,47 88,60 88,64 32,64 40,49 36,51 62,24 54,45 88,68 88,67 88,63 88,58 54,56 54,65
HDMI_CH0_N  (1 unrouted)
  Top 0.191: IC2.20 42.75,23 42.25,22.5 42.25,18 45.25,15 45.25,13 45.5,12.75 J2.9
HDMI_CH0_P  (1 unrouted)
  Top 0.191: IC2.21 43.25,23.25 43.75,22.75 43.75,17.25 46.75,14.25 46.75,13 46.5,12.75 J2.7
HDMI_CH1_N  (via drill 0.35 pad 0.7)
  Top 0.191: v47,8 J2.6 47,12.51 47.25,12.76 47.25,14.5 44.25,17.5 IC2.23
  Bottom 0.191: v47,8 47,13.5 47.5,14 IC3.5
HDMI_CH1_P  (via drill 0.35 pad 0.7)
  Top 0.191: v48,8 J2.4 48,12.51 47.75,12.76 47.75,14.75 44.75,17.75 IC2.24
  Bottom 0.191: IC3.4 v48,8
HDMI_CH2_N  (via drill 0.35 pad 0.7)  (1 unrouted)
  Top 0.191: J2.3 48.5,12.75 48.25,13 48.25,14 v49,14
  Bottom 0.191: IC3.2 v49,14
HDMI_CH2_P  (via drill 0.35 pad 0.7)
  Top 0.191: J2.1 49.5,12.5 50,13 v50,14 46.25,17.75 IC2.27
  Bottom 0.191: v50,14 49.5,14.5 IC3.1
HDMI_CLK_N  (via drill 0.35 pad 0.7)
  Top 0.191: v44,8 J2.12 44,13 40.25,16.75 40.25,22.25 41.25,23.25 IC2.17
  Bottom 0.191: IC3.11 44.5,14.6 44.75,14.35 44.75,13.75 44,13 v44,8
HDMI_CLK_P  (via drill 0.35 pad 0.7)
  Top 0.191: v45,8 J2.10 45,12.5 44.75,12.75 44.75,14.75 41.75,17.75 IC2.18
  Bottom 0.191: IC3.10 45,14.85 45.25,14.6 45.25,13.5 45,13.25 v45,8
HDMI_HPD  (via drill 0.35 pad 0.7)
  Top 0.191: J2.19 40.5,13.5 v40,14 39.26,14.74 IC2.16
  Bottom 0.191: D2.4 40.15,14.15 v40,14 40.25,13.75 40.25,7.15 40.75,6.65 R9.1
HDMI_SCL  (via drill 0.35 pad 0.7)
  Top 0.191: v42,14 v42.01,14 42.5,13.51 J2.15 42.5,8.5 44,7 53,7 54.75,8.75 54.75,23.25 51.75,26.25 IC2.33
  Bottom 0.191: 42.75,14 43.25,13.5 43.25,7.75 44.35,6.65 R11.2 | D2.1 42.5,16.5 42.75,16.25 42.75,14.25 | 42.75,14.25 42.75,14 | v42,14 42.5,14 | 42.5,14 42.75,14 | 42.5,14 42.75,14.25
HDMI_SDA  (via drill 0.35 pad 0.7)
  Top 0.191: J2.16 v42,8 43.5,6.5 53.25,6.5 55.25,8.5 55.25,23.5 52,26.75 IC2.34
  Bottom 0.191: D2.3 41.85,15.1 41.25,14.5 41.25,13.75 42,13 v42,8 42,7 42.35,6.65 R10.2
HOST_D0_N  (via drill 0.35 pad 0.7)
  Top 0.191: R3.1 v79,22 80.25,23.25 82.77,23.25 85.5,25.98 85.5,27.77 85.27,28 IC1.18
  Bottom 0.191: C11.1 v79,22
HOST_D0_P  (via drill 0.35 pad 0.7)
  Top 0.191: IC1.17 84.24,25.49 82.5,23.75 78.75,23.75 v77,22 R4.1
  Bottom 0.191: v77,22 C12.1
HOST_D1_N  (via drill 0.35 pad 0.7)  (1 unrouted)
  Top 0.191: R5.1 v83,22 86.5,25.5 86.5,29.5 85.6,30.4 IC1.21
  Bottom 0.191: C13.1 v83,22
HOST_D1_P  (via drill 0.35 pad 0.7)
  Top 0.191: R6.1 v81,22 81.75,22.75 83.02,22.75 86,25.73 86,29.02 85.42,29.6 IC1.20
  Bottom 0.191: C14.1 v81,22
HOST_DEBUG  (via drill 0.35 pad 0.7)  (1 unrouted)
  Top 0.191: IC1.11 78.8,24.55 78,23.75 76.5,23.75 74.75,22 74.75,20.5 74.25,20 v72,20
HOST_MISO
  Top 0.191: IC1.25 82.8,35.95 81.5,37.25 69.5,37.25 57,49.75 IC4.74
HOST_MOSI
  Top 0.191: IC1.24 84.24,35.26 81.75,37.75 69.75,37.75 57.25,50.25 IC4.75
HOST_SCK
  Top 0.191: IC1.23 85.25,32 85.5,32.25 85.5,34.75 82,38.25 70,38.25 57.5,50.75 IC4.76
HOST_VCC  (via drill 0.35 pad 0.7)  (9 unrouted)
  Top 0.191: IC1.22 82.8,31.2 v82,32 | v75,24 74,25 D1.C 73.15,24.9 71.35,23.1 R2.2
  Bottom 0.191: TP4.TP 74,25 v75,24 | C10.2 v78,32 | C7.2 v80,32 | C9.2 v80,28
HOST_VPLL  (via drill 0.35 pad 0.7)  (1 unrouted)
  Top 0.191: IC1.3 76.82,31.2 v78.02,30
  Bottom 0.191: C16.1 v78.02,30
HOST_VREG  (via drill 0.35 pad 0.7)
  Top 0.191: v78.02,28 IC1.7
  Bottom 0.191: C15.1 v78.02,28 | v78.02,28 78.02,26.25 77.77,26 L2.1 | C17.1 79.1,28.33 78.77,28 v78.02,28
HOST_XTAL0  (1 unrouted)
  Top 0.191: IC1.4 74.4,30.4 74,30 72,30 71.07,30.93 Y1.1 71.07,31.3 72.67,32.9 C1.1
HOST_XTAL1
  Top 0.191: IC1.5 74.6,29.6 73.85,28.85 Y1.3 72.97,28.7 71.37,27.1 C2.1
N$2  (via drill 0.35 pad 0.7)  (1 unrouted)
  other vias: 81,18 83,18
N$4
  Top 0.191: R8.2 38.1,27.1 38.25,27.25 IC2.14
N$9  (via drill 0.35 pad 0.7)
  Top 0.191: IC6.3 59.9,33.6 60,33.5 v60,32
  Bottom 0.191: R17.1 v60,32
N$10  (via drill 0.35 pad 0.7)
  Top 0.191: IC6.7 60.1,26.4 60,26.5 v60,28
  Bottom 0.191: R18.1 v60,28
PWR_BST  (1 unrouted)
PWR_FB  (3 unrouted)
PWR_SW  (2 unrouted)
SD_CLK
  Top 0.191: IC4.29 32.75,52.75 31,51 31,26.25 13,8.25 13,6.25 13.07,6.17 J4.5
SD_MISO
  Top 0.191: IC4.28 32.5,53.25 30.5,51.25 30.5,26.5 11,7 11,6.25 10.88,6.12 J4.7
SD_MOSI
  Top 0.191: IC4.31 32.5,51.75 31.5,50.75 31.5,26 15.25,9.75 15.25,5.83 J4.3
USB0_VCC
  Bottom 0.191: L3.2 81,6.75 81.25,7 82.25,7 | 82.25,7 83,7 | 83,7 84.75,7 85,6.75 C6.1 | C5.1 83,7 | J1.1 77.86,13.75 81.75,13.75 82.25,13.25 82.25,7
USB1_VCC
  Bottom 0.191: C3.1 75,6.75 75.25,7 77,7 | 77,7 77.75,7 | 77.75,7 78.75,7 79,6.75 L1.2 | C4.1 77,7 | J1.5 77.75,11.24 77.75,7
USB_OUT_D0_N
  Top 0.191: J1.2 79.01,15.11 79,15.1 R3.2
USB_OUT_D0_P
  Top 0.191: R4.2 77,19.73 77.27,20 81.77,20 82.02,19.75 82.02,18.02 81.02,17.02 J1.3
USB_OUT_D1_N
  Top 0.191: J1.6 80.25,11.25 81.5,11.25 82.25,12 82.25,15.75 83,16.5 R5.2
USB_OUT_D1_P
  Top 0.191: J1.7 80,13.49 80,16.75 81,17.75 R6.2
VDRAM_ADDR0  (via drill 0.35 pad 0.7)
  Top 0.191: IC5.23 74.32,50.75 75.25,50.75 75.5,51 v77,51 | v39,56 38.25,56 38,56.25 34.5,56.25
  BottomInner 0.191: v77,51 76,50 59,50 58,51 44,51 v39,56
VDRAM_ADDR1
  Top 0.191: IC5.24 61,50 58.75,52.25 IC4.79
VDRAM_ADDR2  (via drill 0.35 pad 0.7)
  Top 0.191: IC5.25 74.32,49.25 75.25,49.25 75.5,49 v76,49 | v38,54 36.75,55.25 34.75,55.25
  BottomInner 0.191: v76,49 75,48 56,48 54,50 42,50 v38,54
VDRAM_ADDR3
  Top 0.191: IC5.26 74.17,48.5 73.5,48.5 73,48 61,48 57.75,51.25 IC4.77
VDRAM_ADDR4  (via drill 0.35 pad 0.7)
  Top 0.191: IC5.29 85.58,48.25 84.75,48.25 84.5,48 v83,48 | v37,54 36.25,54.75 34.75,54.75
  Bottom 0.191: v83,48 82,47 73,47 72,48 56,48 54,50 41,50 v37,54
VDRAM_ADDR5  (via drill 0.35 pad 0.7)
  Top 0.191: IC5.30 85.68,49.25 84.75,49.25 84.5,49 v84,49 | v59,51 58.25,51.75 IC4.78
  TopInner 0.191: v84,49 77,49 76,48 62,48 v59,51
VDRAM_ADDR6  (via drill 0.35 pad 0.7)
  Top 0.191: IC5.31 v83,50 | v38,55 37.25,55.75 34.75,55.75
  Bottom 0.191: v38,55 42,51 53.75,51 54.75,50 v83,50
VDRAM_ADDR7  (via drill 0.35 pad 0.7)
  Top 0.191: v84,51 84.5,51 84.75,50.75 85.68,50.75 IC5.32 | v59,53 57.25,53 57,52.75 IC4.80
  TopInner 0.191: v84,51 78,51 77,50 62,50 v59,53
VDRAM_ADDR8  (via drill 0.35 pad 0.7)
  Top 0.191: IC5.33 85.63,51.5 84.75,51.5 84.25,52 v83,52 | v38,57 37.25,57 37,56.75 34.5,56.75
  Bottom 0.191: v83,52 77,52 76.25,51.25 75.75,51.25 75,52 44,52 39,57 v38,57
VDRAM_ADDR9  (via drill 0.35 pad 0.7)
  Top 0.191: IC5.34 85.63,52.5 84.5,52.5 v84,53 | v59,56 57.75,56 57,56.75 IC4.88
  TopInner 0.191: v84,53 78,53 76.25,51.25 75.75,51.25 75,52 63,52 v59,56
VDRAM_ADDR10
  Top 0.191: IC5.22 74.17,51.5 73.25,51.5 72.75,52 61,52 59.25,53.75 57.25,53.75 56.75,53.25 IC4.81
VDRAM_ADDR11  (via drill 0.35 pad 0.7)
  Top 0.191: IC5.35 85.68,53.25 84.75,53.25 84,54 v83,54 | v36,58 35.5,58 35.25,57.75 34.75,57.75
  Bottom 0.191: v83,54 77,54 76.25,53.25 75.75,53.25 75,54 43,54 38.25,58.75 36.75,58.75 v36,58
VDRAM_BANK0
  Top 0.191: IC5.20 74.22,53.25 73.25,53.25 72.5,54 61,54 59.75,55.25 57.75,55.25 56.75,56.25 IC4.87
VDRAM_BANK1  (via drill 0.35 pad 0.7)
  Top 0.191: IC5.21 74.37,52.5 75.5,52.5 v76,52 | v37,58 36.25,57.25 34.75,57.25
  BottomInner 0.191: v76,52 44,52 38,58 v37,58
VDRAM_CKE  (via drill 0.35 pad 0.7)
  Top 0.191: IC5.37 85.68,54.75 84.75,54.75 84.5,55 v84,55 | v60,58 58.75,58 58.5,58.25 IC4.91
  TopInner 0.191: v84,55 76,55 75,54 64,54 v60,58
VDRAM_DATA0  (via drill 0.35 pad 0.7)
  Top 0.191: IC5.2 74.37,67.5 75.5,67.5 v76,68 | v39,67 37.75,67 37.25,67.5 37.25,68.5
  BottomInner 0.191: v76,68 74,66 60,66 58.25,67.75 54.75,67.75 53,66 40,66 v39,67
VDRAM_DATA1
  Top 0.191: 56.25,65.75 57.75,65.75 58.75,66.75 59.25,66.75 60,66 IC5.4
VDRAM_DATA2  (via drill 0.35 pad 0.7)
  Top 0.191: IC5.5 74.32,65.25 75.25,65.25 75.5,65 v77,65 | v39,66 38,66 36.75,67.25 36.75,68.75
  BottomInner 0.191: v77,65 76,64 61,64 60.25,64.75 58.75,64.75 58,64 41,64 v39,66
VDRAM_DATA3
  Top 0.191: IC5.7 74.17,63.5 73.25,63.5 72.75,64 61,64 60.25,64.75 58.75,64.75 58.25,64.25 57.25,64.25 56.75,64.75 56.25,64.75
VDRAM_DATA4  (via drill 0.35 pad 0.7)
  Top 0.191: IC5.8 74.32,62.75 75.25,62.75 75.5,63 v77,63 | v35,68 35.75,68.75 36.25,68.75
  BottomInner 0.191: v77,63 76,63 75,62 55,62 54.25,61.25 53.75,61.25 53,62 42,62 36,68 v35,68
VDRAM_DATA5
  Top 0.191: IC5.10 74.22,61.25 72.75,61.25 72,62 61,62 60.75,61.75 58.5,61.75 58,62.25 56.25,62.25
VDRAM_DATA6  (via drill 0.35 pad 0.7)
  Top 0.191: IC5.11 74.37,60.5 76.5,60.5 v77,61 | 34.75,65.25 35.25,65.25 35.75,65.75 36.25,65.75 v37,65
  BottomInner 0.191: v77,61 76,60 62,60 61.25,60.75 59.75,60.75 59,60 42,60 v37,65
VDRAM_DATA7
  Top 0.191: IC5.13 74.22,58.75 72.25,58.75 71,60 62,60 60.75,61.25 58.25,61.25 57.75,61.75 56.25,61.75
VDRAM_DATA8  (via drill 0.35 pad 0.7)
  Top 0.191: IC5.42 85.68,58.75 84.75,58.75 84.5,59 v83,59 | v61,60 60.25,60.75 58,60.75 57.5,61.25 56.25,61.25
  TopInner 0.191: v83,59 76,59 75,58 63,58 v61,60
VDRAM_DATA9  (via drill 0.35 pad 0.7)
  Top 0.191: IC5.44 85.63,60.5 84.75,60.5 84.25,61 v83,61 | v60,63 59.25,62.25 58.75,62.25 57.75,63.25 56.25,63.25
  TopInner 0.191: v83,61 78,61 77,60 63,60 v60,63
VDRAM_DATA10  (via drill 0.35 pad 0.7)
  Top 0.191: IC5.45 84.8,61.2 v84,62 | v37,62.5 36.5,62.5 36.25,62.75 34.75,62.75
  Bottom 0.191: v84,62 79.75,62 76.75,59 73,59 72,58 61,58 60.25,57.25 59.75,57.25 59,58 42.25,58 37.75,62.5 v37,62.5
VDRAM_DATA11  (via drill 0.35 pad 0.7)
  Top 0.191: IC5.47 85.68,62.75 84.75,62.75 84.5,63 v83,63 | v60,64 58.75,64 58.5,63.75 56.25,63.75
  TopInner 0.191: v83,63 78,63 76.25,61.25 75.75,61.25 75,62 62,62 v60,64
VDRAM_DATA12  (via drill 0.35 pad 0.7)
  Top 0.191: IC5.48 86.65,63.6 87.25,63 87.25,62.75 v88,62 | v37,64 35.75,64 35.5,63.75 34.75,63.75
  Bottom 0.191: v88,62 87,63 84,63 83.25,63.75 80.75,63.75 77,60 62,60 61.25,59.25 59.75,59.25 59,60 55,60 53,62 40,62 38,64 v37,64
VDRAM_DATA13  (via drill 0.35 pad 0.7)
  Top 0.191: IC5.50 85.68,65.25 84.75,65.25 84.5,65 v83,65 | v58,65 57.25,65 57,65.25 56.25,65.25
  TopInner 0.191: v83,65 78.25,65 77.25,64 61,64 60,65 v58,65
VDRAM_DATA14  (via drill 0.35 pad 0.7)
  Top 0.191: IC5.51 v84,66 | 34.75,65.75 35,65.75 35.5,66.25 36.75,66.25 v38,65
  Bottom 0.191: v84,66 79.25,66 77.25,64 61,64 60.25,64.75 59.75,64.75 59,64 39,64 v38,65
VDRAM_DATA15  (via drill 0.35 pad 0.7)
  Top 0.191: IC5.53 85.63,67.5 84.5,67.5 v84,68 | v58,67 57.25,66.25 56.25,66.25
  TopInner 0.191: v84,68 77,68 75,66 61,66 60,67 v58,67
VDRAM_LDQM  (via drill 0.35 pad 0.7)
  Top 0.191: IC5.15 74.32,57.25 75.25,57.25 75.5,57 v77,57 | v37.75,63.25 34.75,63.25
  BottomInner 0.191: v77,57 76,57 75,58 61,58 60.25,57.25 58.75,57.25 58,58 43,58 v37.75,63.25
VDRAM_UDQM  (via drill 0.35 pad 0.7)
  Top 0.191: IC5.39 85.63,56.5 84.5,56.5 v84,57 | v60,60 58.75,60 58.5,60.25 57.5,60.25 57,60.75 56.25,60.75
  TopInner 0.191: v84,57 78,57 77.25,56.25 76.75,56.25 76.25,56.75 75.75,56.75 75,56 64,56 v60,60
VDRMA_CLK  (via drill 0.35 pad 0.7)
  Top 0.191: IC5.38 85.63,55.5 84.75,55.5 84.25,56 v83,56 | v37,60 37,60.5 35.75,61.75 34.75,61.75
  Bottom 0.191: v83,56 77,56 76.25,55.25 75.5,55.25 74.75,56 60.5,56 59.75,55.25 42.75,55.25 38,60 v37,60
VIDEO_BLUE0
  Top 0.191: IC2.62 42.25,38 | 42.25,38 42.25,38.5 | 42.25,38.5 36.75,44 IC4.38 | IC2.61 42.75,38 42.5,38.25 | 42.5,38.25 42.25,38.5 | 42.25,38 42.5,38.25
VIDEO_BLUE1
  Top 0.191: IC2.60 43.25,37.75 | 43.25,37.75 43.25,38.25 | 43.25,38.25 37.25,44.25 IC4.39 | IC2.59 43.75,37.75 43.5,38 | 43.5,38 43.25,38.25 | 43.25,37.75 43.5,38
VIDEO_BLUE2
  Top 0.191: IC2.58 44.25,37.5 | 44.25,37.5 44.25,38 | 44.25,38 38.25,44 IC4.41 | IC2.57 44.75,37.5 44.5,37.75 | 44.5,37.75 44.25,38 | 44.25,37.5 44.5,37.75
VIDEO_BLUE3
  Top 0.191: IC2.56 45.25,37.25 | 45.25,37.25 45.25,37.75 | 45.25,37.75 38.75,44.25 IC4.42 | IC2.55 45.75,37.25 45.5,37.5 | 45.5,37.5 45.25,37.75 | 45.25,37.25 45.5,37.5
VIDEO_CLK
  Top 0.191: IC4.43 39.25,44.5 46.75,37 IC2.53
VIDEO_DE
  Top 0.191: IC2.63 41.75,38.25 36.25,43.75 IC4.37
VIDEO_GREEN0
  Top 0.191: IC2.54 46.25,34.75 46.5,34.5 47,34.5 47.25,34.75 IC2.52 47.25,37.25 39.75,44.75 IC4.44
VIDEO_GREEN1  (1 unrouted)
  Top 0.191: IC4.45 40.25,45 48.25,37 IC2.50
VIDEO_GREEN2  (1 unrouted)
  Top 0.191: IC4.47 41.25,44.75 50.74,35.26 IC2.48
VIDEO_GREEN3
  Top 0.191: IC4.48 41.75,45 52,34.75 52,33 | 52,32.5 51.75,32.25 IC2.45 | 52,33 52,32.75 | 52,32.75 52,32.5 | IC2.46 51.75,32.75 | 52,32.75 51.75,32.75 | 51.75,32.75 52,32.5 | 51.75,32.75 52,33
VIDEO_HSYNC
  Top 0.191: IC4.34 33.25,50.25 33,50 33,46.25 41.25,38 IC2.64
VIDEO_INT  (via drill 0.35 pad 0.7)
  Top 0.191: IC2.28 46.75,25.25 46.25,25.75 46.25,26.25 46.75,26.75 48,26.75 48.25,27 v49,27
  Bottom 0.191: R14.2 v49,27
VIDEO_PD  (via drill 0.35 pad 0.7)
  Top 0.191: IC2.22 43.75,25.25 v43,26
  Bottom 0.191: R15.1 v43,26
VIDEO_RED0
  Top 0.191: IC4.49 42.25,45.25 52.5,35 52.5,31.75 | 52.5,31.75 52.25,31.5 | 52.25,31.5 52,31.25 IC2.43 | IC2.44 52,31.75 | 52.25,31.5 52,31.75 | 52,31.75 52.5,31.75
VIDEO_RED1
  Top 0.191: IC4.50 42.75,45.5 53,35.25 53,31 52.75,30.75 | 52.75,30.75 52.5,30.5 | 52.5,30.5 52.25,30.25 IC2.41 | IC2.42 52.25,30.75 | 52.25,30.75 52.5,30.5 | 52.25,30.75 52.75,30.75
VIDEO_RED2
  Top 0.191: IC4.52 43.75,45.25 53.5,35.5 53.5,30.75 52.5,29.75 | 52.5,29.75 52.25,29.5 | 52.25,29.5 52,29.25 IC2.39 | IC2.40 52,29.75 | 52,29.75 52.25,29.5 | 52,29.75 52.5,29.75
VIDEO_RED3
  Top 0.191: IC2.37 51.75,28.25 52,28.5 | 52.25,28.75 54,30.5 54,35.75 47.75,42 IC4.60 | 52.25,28.75 52,28.5 | IC2.38 51.75,28.75 | 52,28.5 51.75,28.75 | 51.75,28.75 52.25,28.75
VIDEO_SCL  (via drill 0.35 pad 0.7)
  Top 0.191: IC2.35 50.74,27.26 | IC2.35 49.75,27.25 49,28 v49,29 | IC2.35 52.25,27.25 55,30 55,36.25 48.75,42.5 IC4.62
  Bottom 0.191: R13.2 v49,29
VIDEO_SDA  (via drill 0.35 pad 0.7)
  Top 0.191: v49,30 49.75,29.25 49.75,28.75 49.5,28.5 49.5,28 49.75,27.75 IC2.36 52,27.75 54.5,30.25 54.5,36 48.25,42.25 IC4.61
  Bottom 0.191: v49,30 49,30.75 49.25,31 R12.2
VIDEO_VSYNC
  Top 0.191: IC2.2 38.25,33.25 38,33.5 38,40.5 32.5,46 32.5,50.25 33,50.75 IC4.33